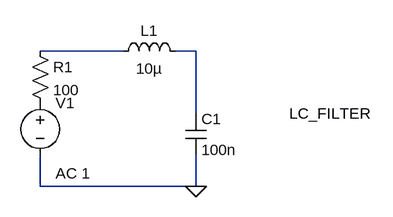
[diagram p0: schematic LCF_2022023.asc]
LCF_2022023.asc, the LTspice schematic file:
Version 4
SHEET 1 880 680
WIRE 176 64 48 64
WIRE 288 64 256 64
WIRE 288 160 288 64
WIRE 48 272 48 224
WIRE 288 272 288 224
WIRE 288 272 48 272
FLAG 288 272 0
SYMBOL voltage 48 128 R0
WINDOW 123 24 124 Left 2
WINDOW 39 0 0 Left 0
SYMATTR Value2 AC 1
SYMATTR InstName V1
SYMATTR Value ""
SYMBOL ind 160 80 R270
WINDOW 0 32 56 VTop 2
WINDOW 3 5 56 VBottom 2
SYMATTR InstName L1
SYMATTR Value 10µ
SYMBOL cap 272 160 R0
SYMATTR InstName C1
SYMATTR Value 100n
SYMBOL res 32 48 R0
SYMATTR InstName R1
SYMATTR Value 100
TEXT 432 160 Left 2 !LC_FILTER

The netlist it stands for:
* LCF_2022023.asc
V1 P001 0 AC 1
L1 N001 N002 10µ
C1 N002 0 100n
R1 N001 P001 100
LC_FILTER
.backanno
.end